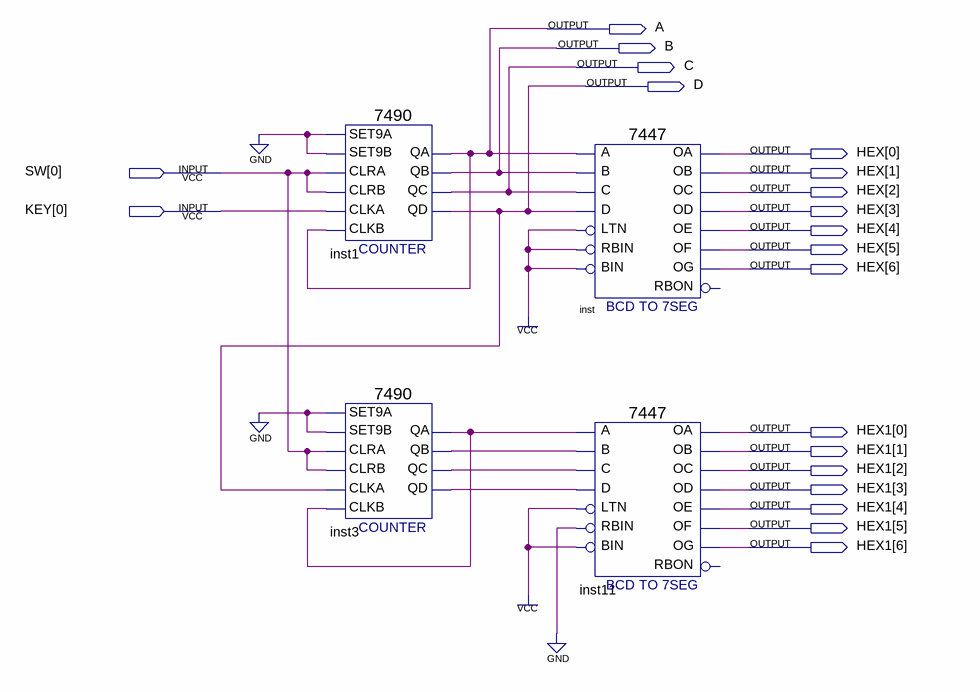
[diagram p0: schematic sheet]
// Quartus schematic 2digitsSeg.bdf as structural Verilog: 4 symbols, 20 pins
module \2digitsSeg  (
  input  [0:0] SW,
  input  [0:0] KEY,
  output A,
  output B,
  output C,
  output D,
  output [6:0] HEX,
  output [6:0] HEX1
);

  wire inst3_qa, inst3_qb, inst3_qc, inst3_qd;

  \7490  inst1 (
    .SET9A(1'b0), .CLRA(SW[0]), .SET9B(1'b0), .CLKB(A), .CLKA(KEY[0]), .CLRB(SW[0]), .QD(D), .QA(A), .QB(B),
    .QC(C));
  \7490  inst3 (
    .SET9A(1'b0), .CLRA(SW[0]), .SET9B(1'b0), .CLKB(inst3_qa), .CLKA(D), .CLRB(SW[0]), .QD(inst3_qd),
    .QA(inst3_qa), .QB(inst3_qb), .QC(inst3_qc));
  \7447  inst (
    .LTN(1'b1), .B(B), .C(C), .D(D), .RBIN(1'b1), .BIN(1'b1), .A(A), .OB(HEX[1]), .OC(HEX[2]), .OE(HEX[4]),
    .OD(HEX[3]), .OF(HEX[5]), .OG(HEX[6]), .OA(HEX[0]));  // open: RBON
  \7447  inst11 (
    .LTN(1'b1), .B(inst3_qb), .C(inst3_qc), .D(inst3_qd), .RBIN(1'b0), .BIN(1'b1), .A(inst3_qa),
    .OB(HEX1[1]), .OC(HEX1[2]), .OE(HEX1[4]), .OD(HEX1[3]), .OF(HEX1[5]), .OG(HEX1[6]), .OA(HEX1[0]));  // open: RBON
endmodule
